# Altium schematic sheet wtc_sh2.SchDoc
size 414 x 293 mm; SheetNumber: 2; SheetTotal: 4
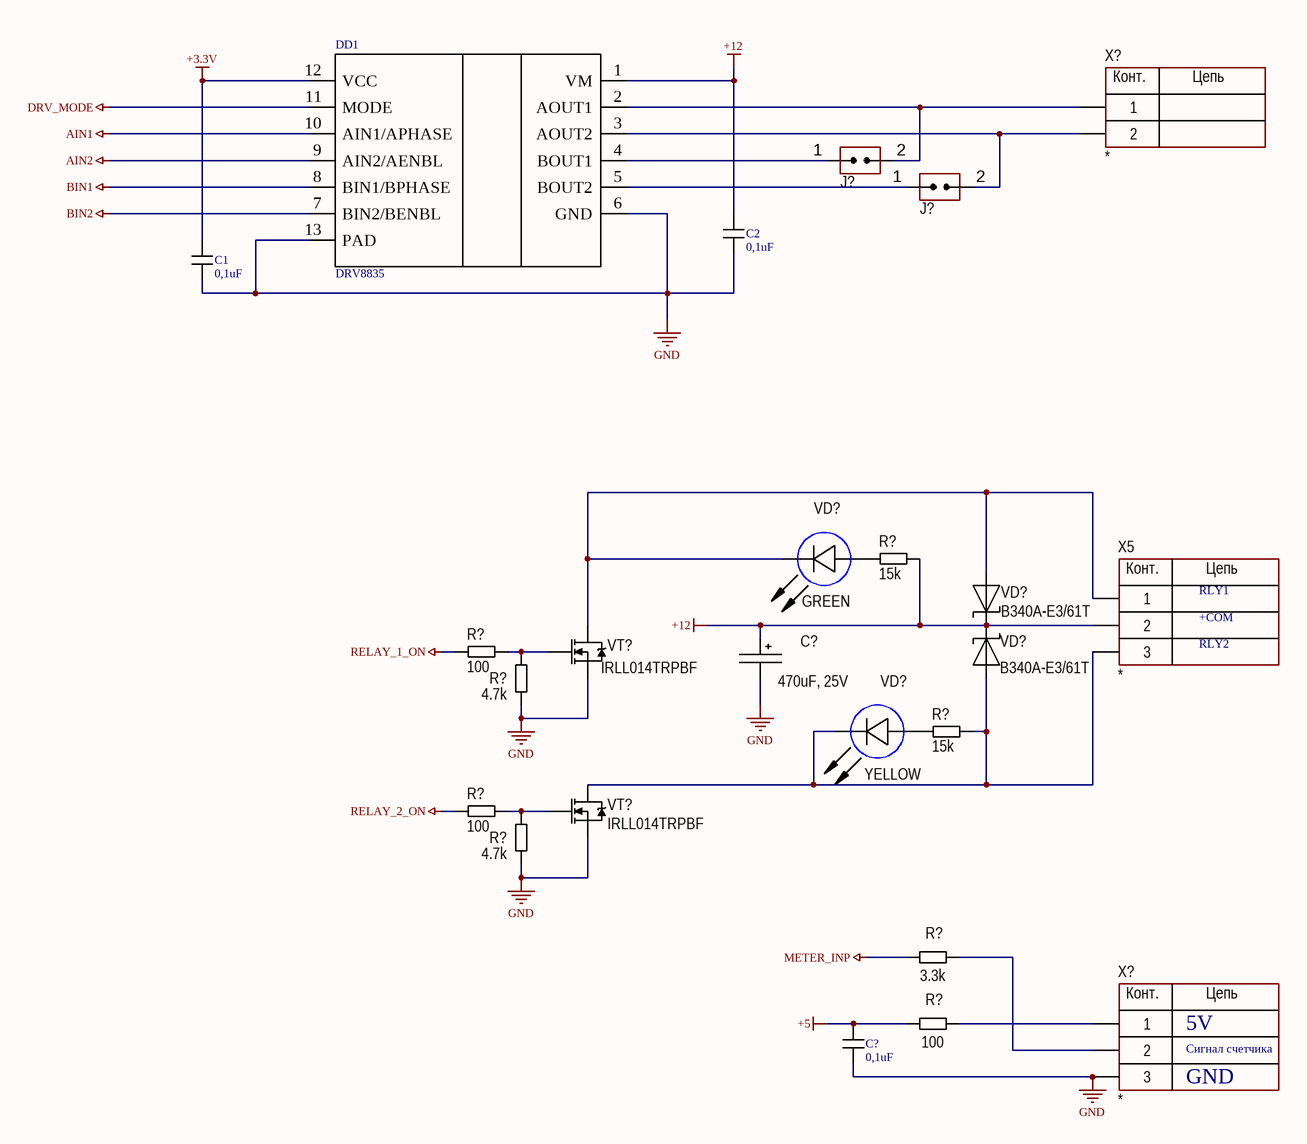
[diagram p0: wtc_sh2.SchDoc]

## Parts
(Parts that share a designator on the sheet are numbered #1, #2 ... from top to bottom, then left to right.)
C1  0,1uF  [C_0603]
C2  0,1uF  [C_0603]
C?#1  470uF, 25V  [D8C3.2H12]
C?#2  0,1uF  [C_0603]
DD1  DRV8835  [WSON12]
J?#1  Jumper-2  [CON: PLS-2]  (value not drawn)
J?#2  Jumper-2  [CON: PLS-2]  (value not drawn)
R?#1  15k  [CH0805R]
R?#2  100  [CH0805R]
R?#3  4.7k  [CH0805R]
R?#4  15k  [CH0805R]
R?#5  100  [CH0805R]
R?#6  4.7k  [CH0805R]
R?#7  3.3k  [CH0805R]
R?#8  100  [CH2512R]
VD?#1  GREEN  [CH0603LB]
VD?#2  B340A-E3/61T  [SMA]
VD?#3  B340A-E3/61T  [SMA]
VD?#4  YELLOW  [CH0603LB]
VT?#1  IRLL014TRPBF  [SOT223]
VT?#2  IRLL014TRPBF  [SOT223]
X5  *  [CON: 300-03P-5.0]
X?#1  *  [CON: CWF-2]
X?#2  *  [CON: WJ06-03P]

## Nets
+3.3V: C1.2 DD1.12(VCC)
+5: C?#2.2 R?#8.1
+12: C2.2 C?#1.1 DD1.1(VM) R?#1.2 VD?#2.2 VD?#3.2 X5.2
AIN1: DD1.10(AIN1/APHASE)
AIN2: DD1.9(AIN2/AENBL)
BIN1: DD1.8(BIN1/BPHASE)
BIN2: DD1.7(BIN2/BENBL)
DRV_MODE: DD1.11(MODE)
GND: C1.1 C2.1 C?#1.2 C?#2.1 DD1.6(GND) DD1.13(PAD) R?#3.1 R?#6.1 VT?#1.3(S) VT?#2.3(S) X?#2.3
METER_INP: R?#7.1
RELAY_1_ON: R?#2.2
RELAY_2_ON: R?#5.2
NetDD1_2: DD1.2(AOUT1) J?#1.2(IN) X?#1.1
NetDD1_3: DD1.3(AOUT2) J?#2.2(IN) X?#1.2
NetDD1_4: DD1.4(BOUT1) J?#1.1(IN)
NetDD1_5: DD1.5(BOUT2) J?#2.1(IN)
NetR?#1_1: R?#1.1 VD?#1.1(A)
NetR?#2_1: R?#2.1 R?#3.2 VT?#1.1(G)
NetR?#4_1: R?#4.1 VD?#4.1(A)
NetR?#4_2: R?#4.2 VD?#3.1 VD?#4.2(C) VT?#2.2(D) X5.3
NetR?#5_1: R?#5.1 R?#6.2 VT?#2.1(G)
NetR?#7_2: R?#7.2 X?#2.2
NetR?#8_2: R?#8.2 X?#2.1
NetVD?#1_2: VD?#1.2(C) VD?#2.1 VT?#1.2(D) X5.1

## Notes on the sheet
- RLY1
- +COM
- RLY2
- 5V
- GND
- Сигнал счетчика
- Лист
- Изм.
- № докум.
- Подпись
- Дата
- (in symbol 2-Connector) Конт.; Цепь
- (in symbol 3-Connector) Конт.; Цепь

## Library data of the parts
C1 C2 C?#2 = C_SMD
C?#1 = AlumCap: Manufacturer: *; Model: *; HelpURL: *; ComponentKind: *; Value: *
DD1 = DRV8835: Driver
J?#1 J?#2 = Jumper-2: Jumper; Manufacturer: China; Model: PLS-2
R?#1-R?#8 = Resistor: Manufacturer: *; Model: *; HelpURL: *; ComponentKind: *; Value: *
VD?#1 VD?#4 = LED_1: Manufacturer: *; Model: *; HelpURL: *; ComponentKind: *; Value: *
VD?#2 VD?#3 = Diod Schottky: ComponentKind: *; Manufacturer: *; Model: *; HelpURL: *
VT?#1 VT?#2 = N-chanel: Mosfet; Model: *; Manufacturer: *; ComponentKind: *; HelpURL: *
X5 X?#2 = 3-Connector: Model: *; Manufacturer: *; HelpURL: *; ComponentKind: *
X?#1 = 2-Connector: Model: *; Manufacturer: *; HelpURL: *; ComponentKind: *